# EAGLE design Wind_Tree_connect (EAGLE 6.3)
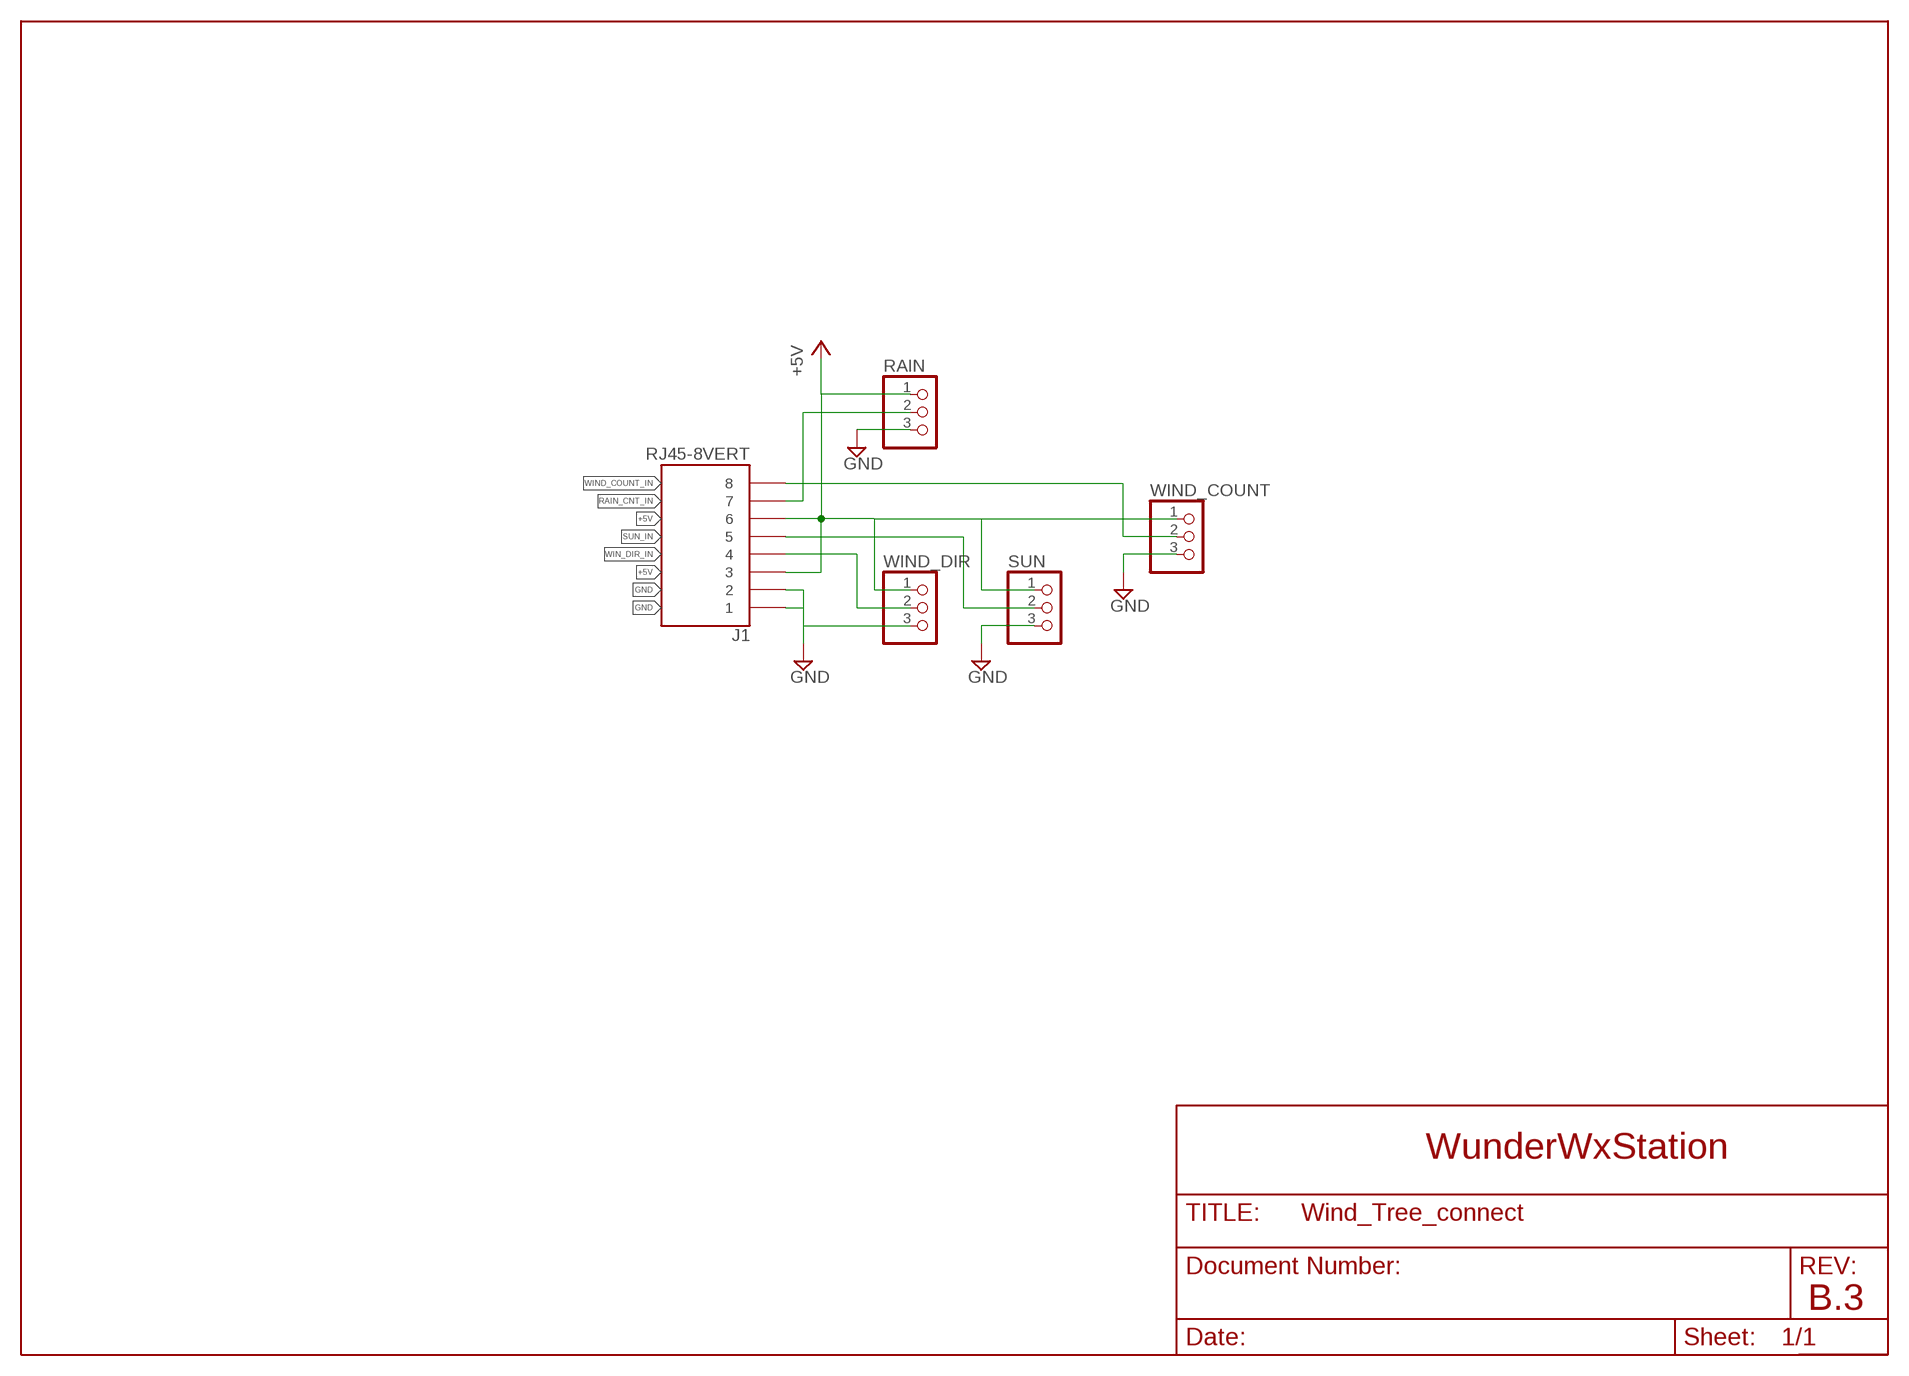
[diagram p0: schematic, sheet 1]

## Parts
J1  RJ45-8VERT  [RJ45_VERT]
RAIN  PINHD-1X3  [1X03]
SUN  PINHD-1X3  [1X03]
WIND_COUNT  PINHD-1X3  [1X03]
WIND_DIR  PINHD-1X3  [1X03]

## Nets
+5V: J1.P$3 J1.P$6 RAIN.1 SUN.1 WIND_COUNT.1 WIND_DIR.1
GND: J1.P$1 J1.P$2 RAIN.3 SUN.3 WIND_COUNT.3 WIND_DIR.3
RAIN_CNT_IN: J1.P$7 RAIN.2
SUN_IN: J1.P$5 SUN.2
WIN_DIR_IN: J1.P$4 WIND_DIR.2
WIND_COUNT_IN: J1.P$8 WIND_COUNT.2

## Notes on the sheet
- WunderWxStation
- B.3

## Library data of the parts
J1 = wifi_WX:RJ45-8: RJ45 Jack Simple RJ45, 8-pin connection - connector for common Cat5, Cat5e, and Cat6 Ethernet cables. Footprint not yet proven in production. Connector sku is PRT-00643; Breakout PCB sku is BOB-00716.
RAIN SUN WIND_COUNT WIND_DIR = wifi_WX:PINHD-1X3: PIN HEADER

## Board
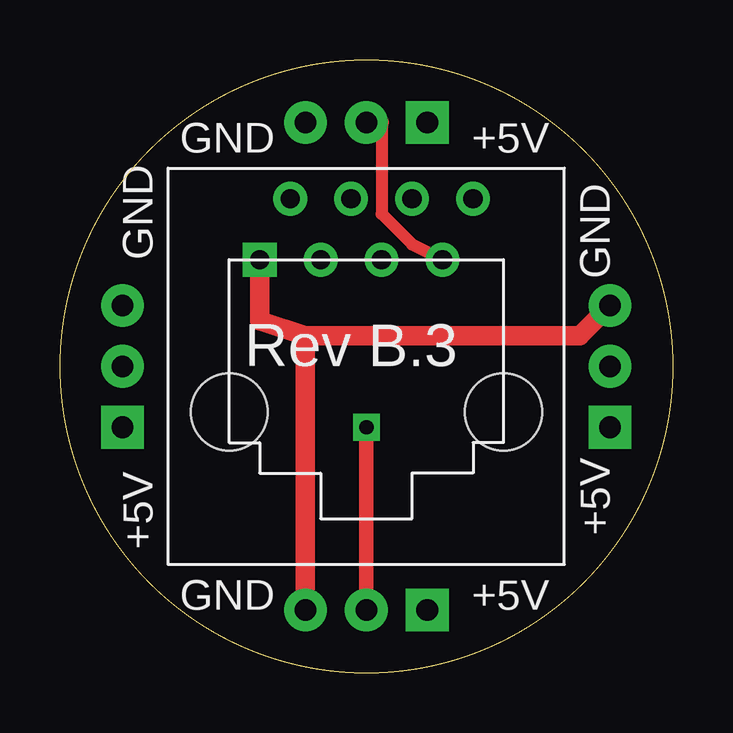
[diagram p1: board, top side]
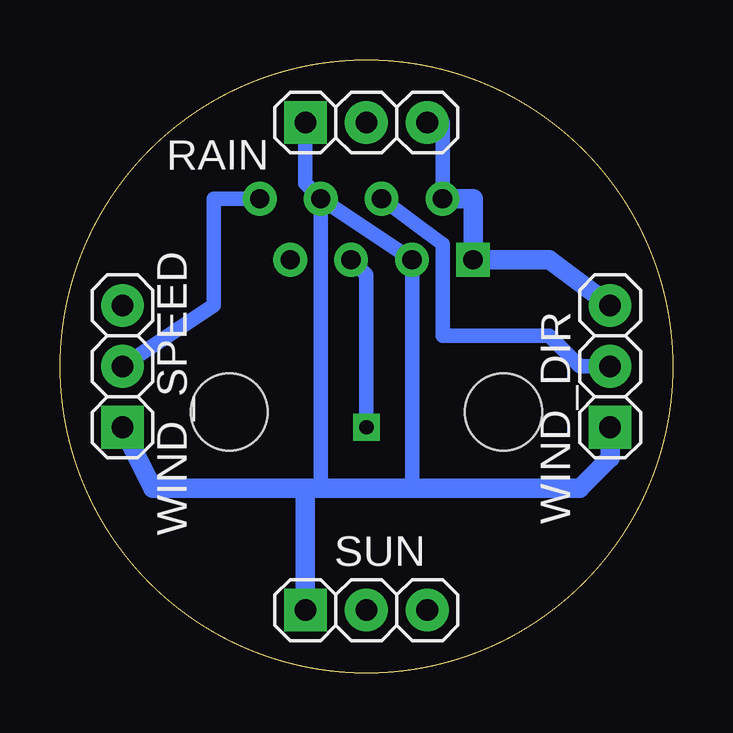
[diagram p2: board, bottom side, seen from below]

Size 25.53 x 25.53 mm. Coordinates in mm from the lower left corner, seen from the top.
Outline: circle at 12.76,12.76 radius 12.76
Copper layers (1*16): Top 0.035mm / dielectric 1.5mm / Bottom 0.035mm
Design rules "sparkfun": minimum track width 8mil, minimum drill 20mil, track to track 8mil, track to pad 8mil, pad to pad 8mil, via to via 8mil, smd to smd 8mil, copper to edge 10mil, drill to drill 8mil, minimum pad ring 12mil, minimum via ring 10mil, stop-mask expansion 4mil, vias tented up to drill 25mil, thermal gap 10mil

### Footprints (pad centres in the part's own frame; a part is rotated, then mirrored left to right if it is on the bottom)
RJ45_VERT = drill 0.8 square: P$1 1.27,6.35 | drill 0.8: P$2 2.54,8.89; P$3 3.81,6.35; P$4 5.08,8.89; P$5 6.35,6.35; P$6 7.62,8.89; P$7 8.89,6.35; P$8 10.16,8.89 | hole 3.2: 0,0; 11.43,0
1X03 = drill 0.9 pad 1.778 square: 1 -2.54,0 | drill 0.9 pad 1.778: 2 0,0; 3 2.54,0

### Placement (x,y rotation side)
J1  7.05,10.86 0 top
RAIN  12.76,22.92 0 bottom
SUN  12.76,2.6 0 bottom
WIND_COUNT  22.92,12.76 90 bottom
WIND_DIR  2.6,12.76 90 bottom

### Tracks (layer width: path | path; a pad name or v marks a point on that pad's centre or on a via)
+5V
  Bottom 0.61: J1.P$6 14.67,8.32 | 14.67,7.68 14.67,8.32 | 14.67,8.32 14.67,7.65 14.67,7.68 | J1.P$6 J1.P$3 10.86,7.68 | J1.P$6 15.3,20.38 RAIN.1
  Bottom 0.813: 14.67,7.68 15.3,7.68 | 15.3,7.68 SUN.1 | WIND_COUNT.1 21.65,7.68 15.3,7.68 | WIND_DIR.1 2.6,8.95 3.87,7.68 10.86,7.68 14.67,7.68
GND
  Top 0.813: J1.P$1 8.32,14.67 10.22,14.03 | 10.22,14.03 SUN.3 | WIND_COUNT.3 21.65,14.03 10.22,14.03
  Bottom 0.61: RAIN.3 9.59,22.92 J1.P$2
  Bottom 0.813: WIND_DIR.3 5.14,17.21 J1.P$1 8.32,19.75 J1.P$2
RAIN_CNT_IN
  Top 0.508: 13.4,22.92 13.4,19.11 14.67,17.84 J1.P$7
  Top 0.61: RAIN.2 13.4,22.92
SUN_IN  (via drill 0.6)
  Top 0.61: SUN.2 v12.76,10.22
  Bottom 0.61: v12.76,10.22 12.76,16.57 J1.P$5
WIN_DIR_IN
  Bottom 0.61: J1.P$4 9.59,17.84 9.59,14.03 5.14,14.03 3.87,12.76 WIND_DIR.2
WIND_COUNT_IN
  Bottom 0.61: J1.P$8 19.11,19.75 19.11,15.3 WIND_COUNT.2

### Text on the board
tPlace: GND | +5V | GND | GND | Rev B.3 | +5V | +5V | GND | +5V
bPlace: WIND_SPEED